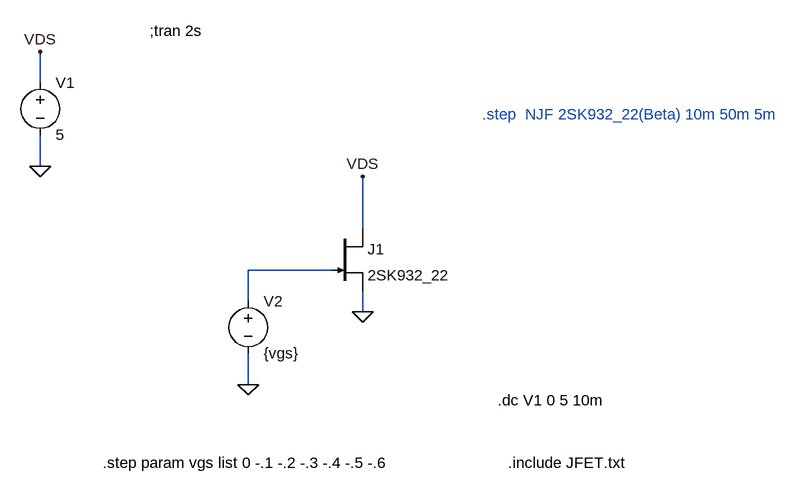
[diagram p0: schematic Linear.asc]
Linear.asc, the LTspice schematic file:
Version 4
SHEET 1 3232 872
WIRE -96 -48 -96 -96
WIRE -96 80 -96 32
WIRE 400 176 400 96
WIRE 352 240 224 240
WIRE 224 288 224 240
WIRE 400 304 400 272
WIRE 224 416 224 368
FLAG -96 -96 VDS
FLAG 400 96 VDS
FLAG -96 80 0
FLAG 400 304 0
FLAG 224 416 0
SYMBOL njf 352 176 R0
SYMATTR InstName J1
SYMATTR Value 2SK932_22
SYMBOL voltage -96 -64 R0
WINDOW 123 0 0 Left 0
WINDOW 39 0 0 Left 0
SYMATTR InstName V1
SYMATTR Value 5
SYMBOL voltage 224 272 R0
WINDOW 123 0 0 Left 0
WINDOW 39 0 0 Left 0
SYMATTR InstName V2
SYMATTR Value {vgs}
TEXT 72 -128 Left 2 !;tran 2s
TEXT 608 440 Left 2 !.dc V1 0 5 10m
TEXT 624 536 Left 2 !.include JFET.txt
TEXT 584 0 Left 2 ;.step  NJF 2SK932_22(Beta) 10m 50m 5m
TEXT 0 536 Left 2 !.step param vgs list 0 -.1 -.2 -.3 -.4 -.5 -.6

The netlist it stands for:
* Linear.asc
J1 VDS N001 0 2SK932_22
V1 VDS 0 5
V2 N001 0 {vgs}
.model NJF NJF
.model PJF PJF
.lib standard.jft
;tran 2s
.dc V1 0 5 10m
.include JFET.txt
* .step  NJF 2SK932_22(Beta) 10m 50m 5m
.step param vgs list 0 -.1 -.2 -.3 -.4 -.5 -.6
.backanno
.end